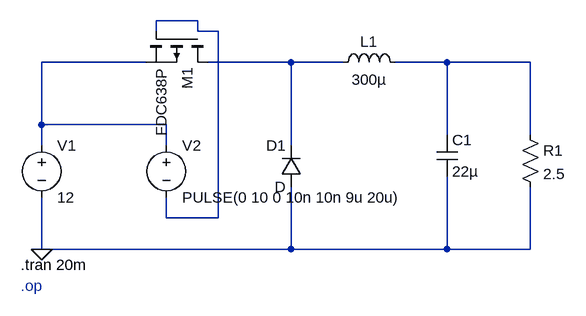
[diagram p0: schematic Buck converter - 1.asc]
Buck converter - 1.asc, the LTspice schematic file:
Version 4.1
SHEET 1 1068 680
WIRE -128 16 -192 16
WIRE -192 32 -192 16
WIRE -128 32 -128 16
WIRE -96 32 -128 32
WIRE -208 80 -368 80
WIRE 16 80 -112 80
WIRE 96 80 16 80
WIRE 256 80 176 80
WIRE 384 80 256 80
WIRE -368 176 -368 80
WIRE -176 176 -368 176
WIRE 256 192 256 80
WIRE 384 192 384 80
WIRE -368 208 -368 176
WIRE -176 208 -176 176
WIRE 16 208 16 80
WIRE -176 320 -176 288
WIRE -96 320 -96 32
WIRE -96 320 -176 320
WIRE -368 368 -368 288
WIRE 16 368 16 272
WIRE 16 368 -368 368
WIRE 256 368 256 256
WIRE 256 368 16 368
WIRE 384 368 384 272
WIRE 384 368 256 368
FLAG -368 368 0
SYMBOL voltage -368 192 R0
WINDOW 123 0 0 Left 0
WINDOW 39 0 0 Left 0
SYMATTR InstName V1
SYMATTR Value 12
SYMBOL voltage -176 192 R0
WINDOW 123 0 0 Left 0
WINDOW 39 0 0 Left 0
SYMATTR InstName V2
SYMATTR Value PULSE(0 10 0 10n 10n 9u 20u)
SYMBOL diode 32 272 R180
WINDOW 0 24 64 Left 2
WINDOW 3 24 0 Left 2
SYMATTR InstName D1
SYMBOL ind 80 96 R270
WINDOW 0 32 56 VTop 2
WINDOW 3 5 56 VBottom 2
SYMATTR InstName L1
SYMATTR Value 300µ
SYMATTR SpiceLine Rser=1m
SYMBOL cap 240 192 R0
SYMATTR InstName C1
SYMATTR Value 22µ
SYMATTR SpiceLine Rser=0.1
SYMBOL res 368 176 R0
SYMATTR InstName R1
SYMATTR Value 2.5
SYMBOL pmos -112 32 R90
SYMATTR InstName M1
SYMATTR Value FDC638P
TEXT -400 392 Left 2 !.tran 20m
TEXT -400 424 Left 2 ;.op

The netlist it stands for:
* Buck converter - 1.asc
V1 N002 0 12
V2 N002 N001 PULSE(0 10 0 10n 10n 9u 20u)
D1 0 N003 D
L1 N003 N004 300µ Rser=1m
C1 N004 0 22µ Rser=0.1
R1 N004 0 2.5
M1 N003 N001 N002 N002 FDC638P
.model D D
.lib standard.dio
.model NMOS NMOS
.model PMOS PMOS
.lib standard.mos
.tran 20m
* .op
.backanno
.end